# EAGLE design Z80_mini (EAGLE 8.1.0)
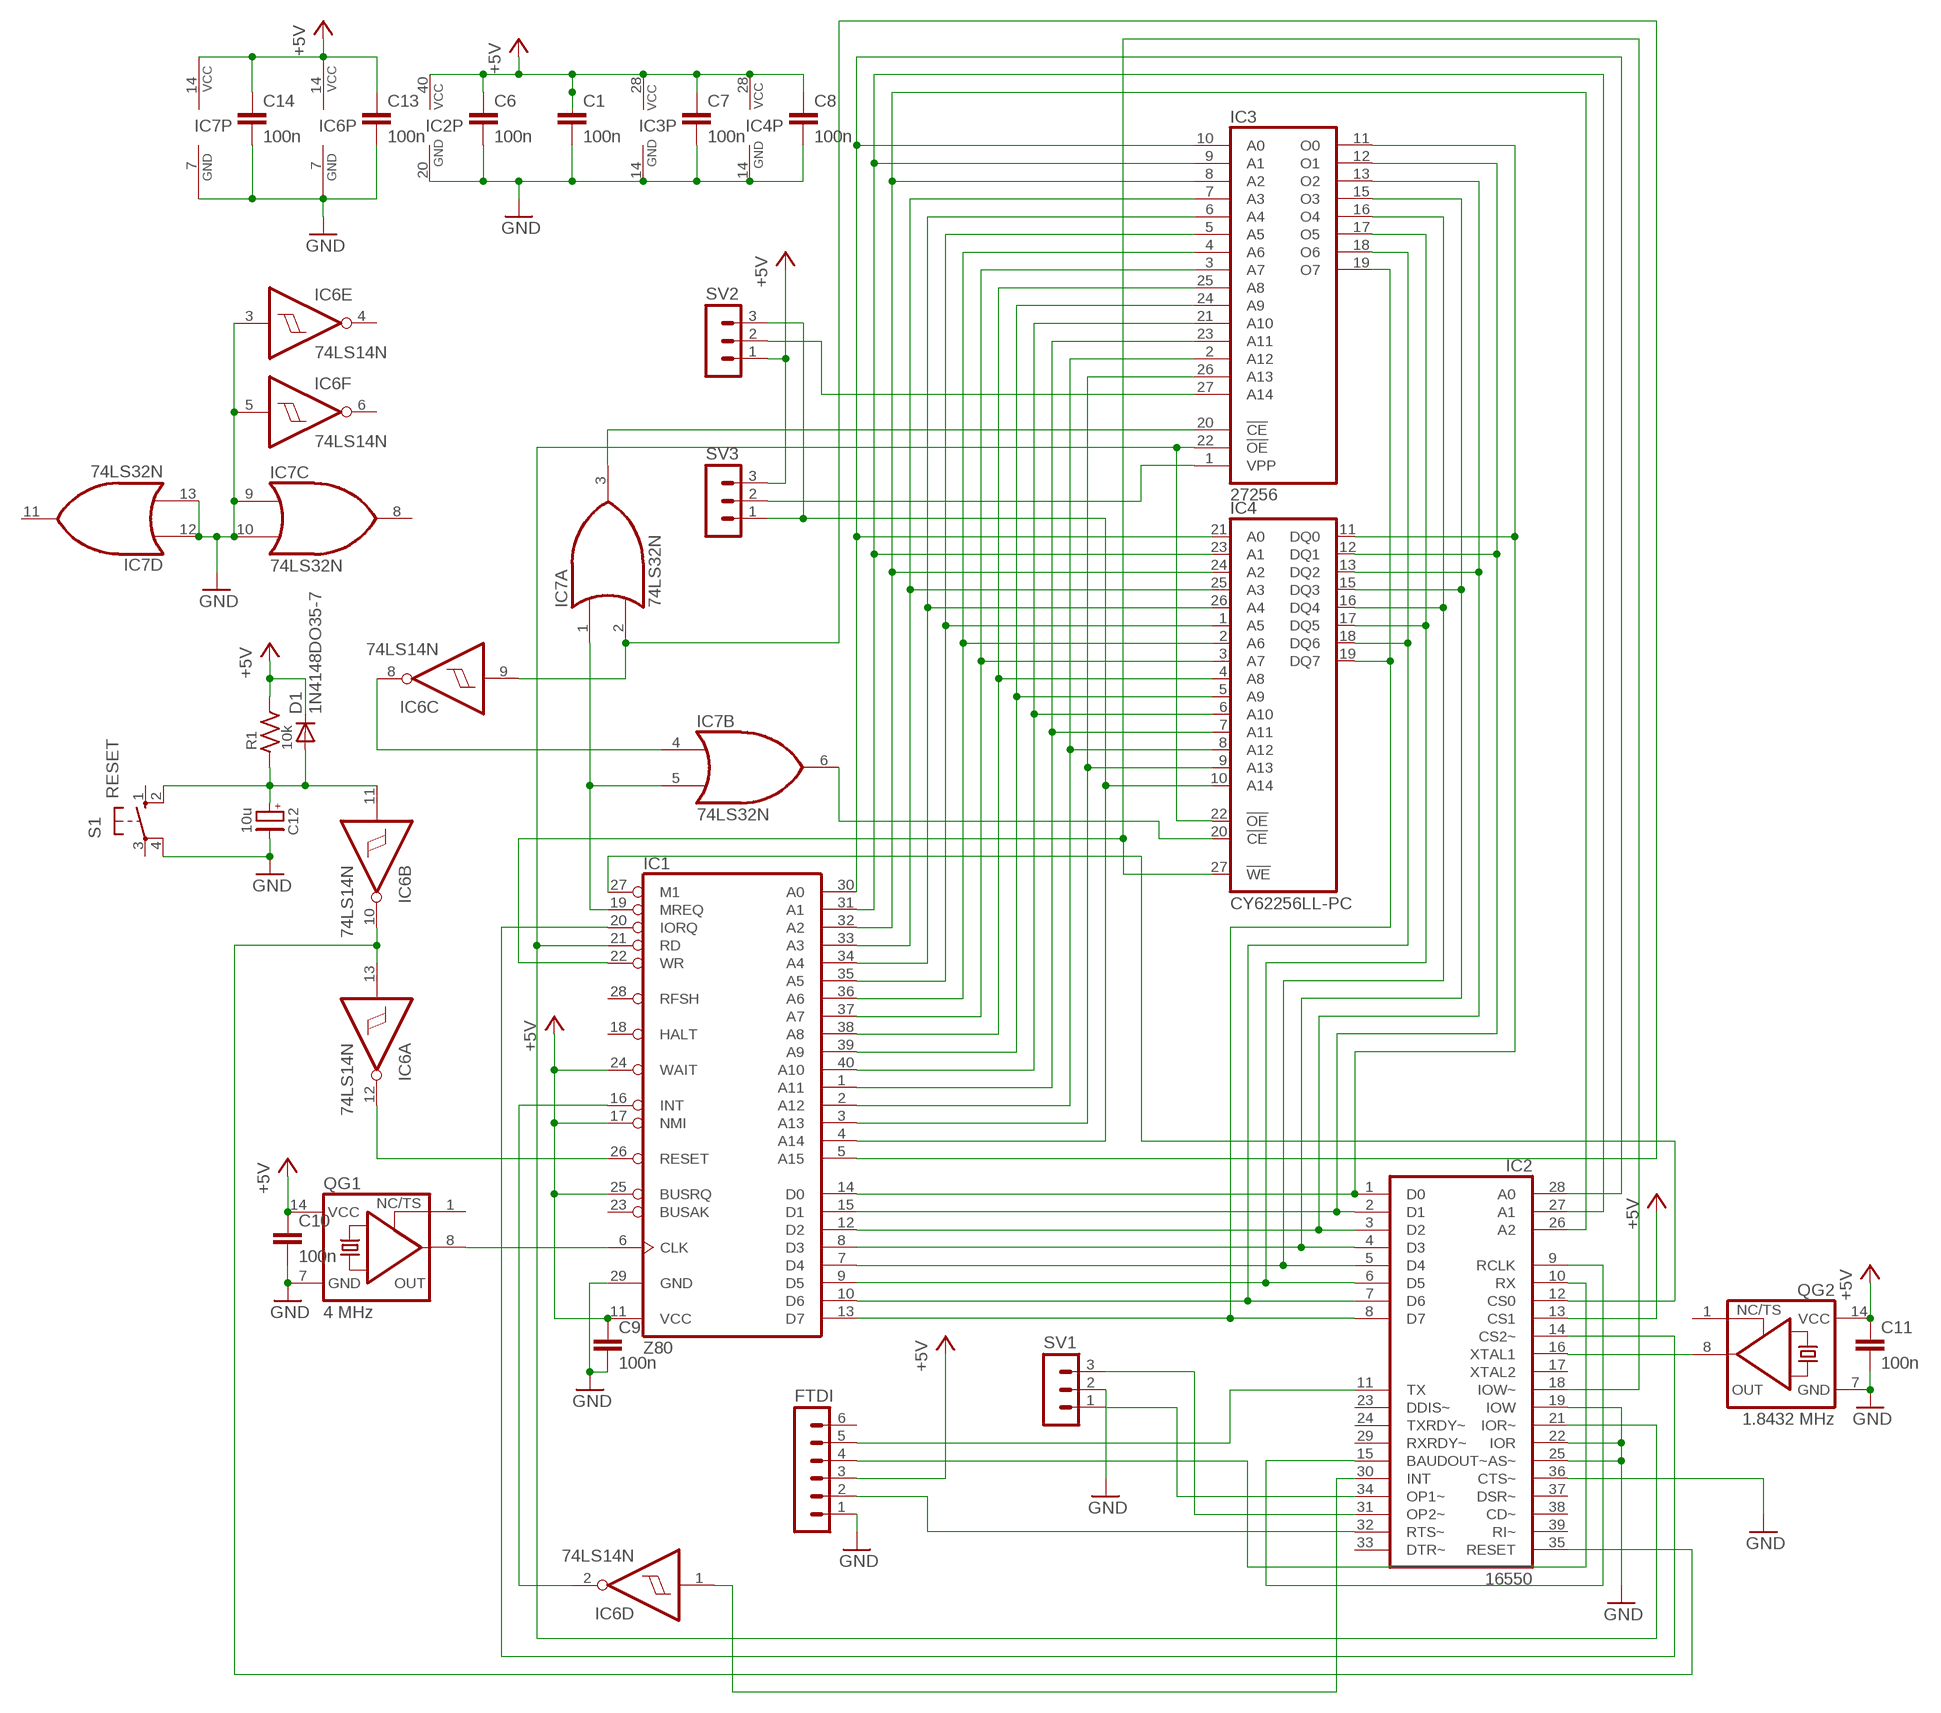
[diagram p0: schematic, sheet 1]

## Parts
C1  100n  C5/2.5  [C5B2.5]
C6  100n  C5/2.5  [C5B2.5]
C7  100n  C5/2.5  [C5B2.5]
C8  100n  C5/2.5  [C5B2.5]
C9  100n  C5/2.5  [C5B2.5]
C10  100n  C5/2.5  [C5B2.5]
C11  100n  C5/2.5  [C5B2.5]
C12  10u  CE01A  [CE01A]
C13  100n  C5/2.5  [C5B2.5]
C14  100n  C5/2.5  [C5B2.5]
D1  1N4148DO35-7  [DO35-7]
FTDI  MA06-1  [MA06-1]
IC1  Z80  Z80CPU  [DIL40]
IC2  16550  XR-16C550P  [DIL40]
IC3  27256  [DIL28]
IC4  CY62256LL-PC  [DIL28-6]
IC6  74LS14N  [DIL14]
IC7  74LS32N  [DIL14]
QG1  4 MHz  XO-14  [DIL14S]
QG2  1.8432 MHz  XO-14  [DIL14S]
R1  10k  RU  [R04N]
S1  RESET  10-XX  [B3F-10XX]
SV1  MA03-1  [MA03-1]
SV2  MA03-1  [MA03-1]
SV3  MA03-1  [MA03-1]

## Nets
+5V: C1.1 C6.1 C7.1 C8.1 C9.1 C10.1 C11.1 C13.1 C14.1 D1.C FTDI.3 IC1.11(VCC) IC1.17(NMI) IC1.24(WAIT) IC1.25(BUSRQ) IC2.13(CS1) IC2.40(VCC) IC3.28(VCC) IC4.28(VCC) IC6.14(P:VCC) IC7.14(P:VCC) QG1.14(VCC) QG2.14(VCC) R1.2 SV2.1 SV3.3
GND: C1.2 C6.2 C7.2 C8.2 C9.2 C10.2 C11.2 C12.- C13.2 C14.2 FTDI.1 IC1.29(GND) IC2.19(IOW) IC2.20(GND) IC2.22(IOR) IC2.25(AS~) IC2.36(CTS~) IC3.14(GND) IC4.14(GND) IC6.3(E:I) IC6.5(F:I) IC6.7(P:GND) IC7.7(P:GND) IC7.9(C:I0) IC7.10(C:I1) IC7.12(D:I0) IC7.13(D:I1) QG1.7(GND) QG2.7(GND) S1.4(P1) SV1.2
N$1: IC1.14(D0) IC2.1(D0) IC3.11(O0) IC4.11(DQ0)
N$2: IC1.15(D1) IC2.2(D1) IC3.12(O1) IC4.12(DQ1)
N$3: IC1.12(D2) IC2.3(D2) IC3.13(O2) IC4.13(DQ2)
N$4: IC1.8(D3) IC2.4(D3) IC3.15(O3) IC4.15(DQ3)
N$5: IC1.7(D4) IC2.5(D4) IC3.16(O4) IC4.16(DQ4)
N$6: IC1.9(D5) IC2.6(D5) IC3.17(O5) IC4.17(DQ5)
N$7: IC1.10(D6) IC2.7(D6) IC3.18(O6) IC4.18(DQ6)
N$8: IC1.13(D7) IC2.8(D7) IC3.19(O7) IC4.19(DQ7)
N$9: IC1.30(A0) IC2.28(A0) IC3.10(A0) IC4.21(A0)
N$10: IC1.31(A1) IC2.27(A1) IC3.9(A1) IC4.23(A1)
N$11: IC1.32(A2) IC2.26(A2) IC3.8(A2) IC4.24(A2)
N$12: IC1.33(A3) IC3.7(A3) IC4.25(A3)
N$13: IC1.34(A4) IC3.6(A4) IC4.26(A4)
N$14: IC1.35(A5) IC3.5(A5) IC4.1(A5)
N$15: IC1.36(A6) IC3.4(A6) IC4.2(A6)
N$16: IC1.37(A7) IC3.3(A7) IC4.3(A7)
N$17: IC1.38(A8) IC3.25(A8) IC4.4(A8)
N$18: IC1.39(A9) IC3.24(A9) IC4.5(A9)
N$19: IC1.40(A10) IC3.21(A10) IC4.6(A10)
N$20: IC1.1(A11) IC3.23(A11) IC4.7(A11)
N$21: IC1.2(A12) IC3.2(A12) IC4.8(A12)
N$22: IC1.3(A13) IC3.26(A13) IC4.9(A13)
N$23: IC1.4(A14) IC4.10(A14) SV2.3 SV3.1
N$24: FTDI.4 IC2.10(RX)
N$25: IC1.21(RD) IC2.21(IOR~) IC3.22(!OE) IC4.22(!OE)
N$26: IC1.22(WR) IC2.18(IOW~) IC4.27(!WE)
N$27: IC1.27(M1) IC2.12(CS0)
N$28: FTDI.2 IC2.32(RTS~)
N$29: IC3.1(VPP) SV3.2
N$30: FTDI.5 IC2.11(TX)
N$31: IC3.27(A14) SV2.2
N$32: IC2.31(OP2~) SV1.3
N$33: IC2.34(OP1~) SV1.1
N$36: IC1.6(CLK) QG1.8(OUT)
N$37: IC1.26(RESET) IC6.12(A:O)
N$38: IC2.16(XTAL1) QG2.8(OUT)
N$39: IC2.9(RCLK) IC2.15(BAUDOUT~)
N$40: IC1.20(IORQ) IC2.14(CS2~)
N$41: IC2.35(RESET) IC6.10(B:O) IC6.13(A:I)
N$43: C12.+ D1.A IC6.11(B:I) R1.1 S1.2(S1)
N$44: IC1.19(MREQ) IC7.1(A:I0) IC7.5(B:I1)
N$46: IC3.20(!CE) IC7.3(A:O)
N$47: IC6.8(C:O) IC7.4(B:I0)
N$48: IC4.20(!CE) IC7.6(B:O)
N$49: IC2.30(INT) IC6.1(D:I)
N$50: IC1.16(INT) IC6.2(D:O)
N$52: IC1.5(A15) IC6.9(C:I) IC7.2(A:I1)
Unconnected: FTDI.6 IC1.18(HALT) IC1.23(BUSAK) IC1.28(RFSH) IC2.17(XTAL2) IC2.23(DDIS~) IC2.24(TXRDY~) IC2.29(RXRDY~) IC2.33(DTR~) IC2.37(DSR~) IC2.38(CD~) IC2.39(RI~) IC6.4(E:O) IC6.6(F:O) IC7.8(C:O) IC7.11(D:O) QG1.1(TS) QG2.1(TS) S1.1(S) S1.3(P)

## Library data of the parts
C1 C6-C11 C13 C14 = capacitor-wima:C: CAPACITOR naming: grid - package width
C12 = divers:CE: Electrolytic capacitor Unipolar
D1 = diode:1N4148: DIODE high speed (Philips)
FTDI = con-lstb:MA06-1: PIN HEADER; OC_FARNELL: unknown; OC_NEWARK: unknown
IC1 = zilog:Z80CPU: Z80 FAMILY DEVICE
IC2 = exar:XR-16C550P: UART/FIFO
IC3 = memory:27256: MEMORY
IC4 = memory-sram:CY62256LL-?*: 256K (32K x 8) CMOS-Static RAM Source: http://download.cypress.com.edgesuite.net/design_resources/datasheets/contents/cy62256_8.pdf
IC6 = 74xx-us:74*14: Hex schmitt trigger INVERTER
IC7 = 74xx-us:74*32: Quad 2-input OR gate
QG1 QG2 = crystal:XO-: CRYSTAL
R1 = divers:RU: Resistor, US symbol
S1 = switch-omron:10-XX: OMRON SWITCH
SV1-SV3 = con-lstb:MA03-1: PIN HEADER; OC_FARNELL: unknown; OC_NEWARK: unknown

## Net classes
0 +5V: width 0.508 mm

## Board
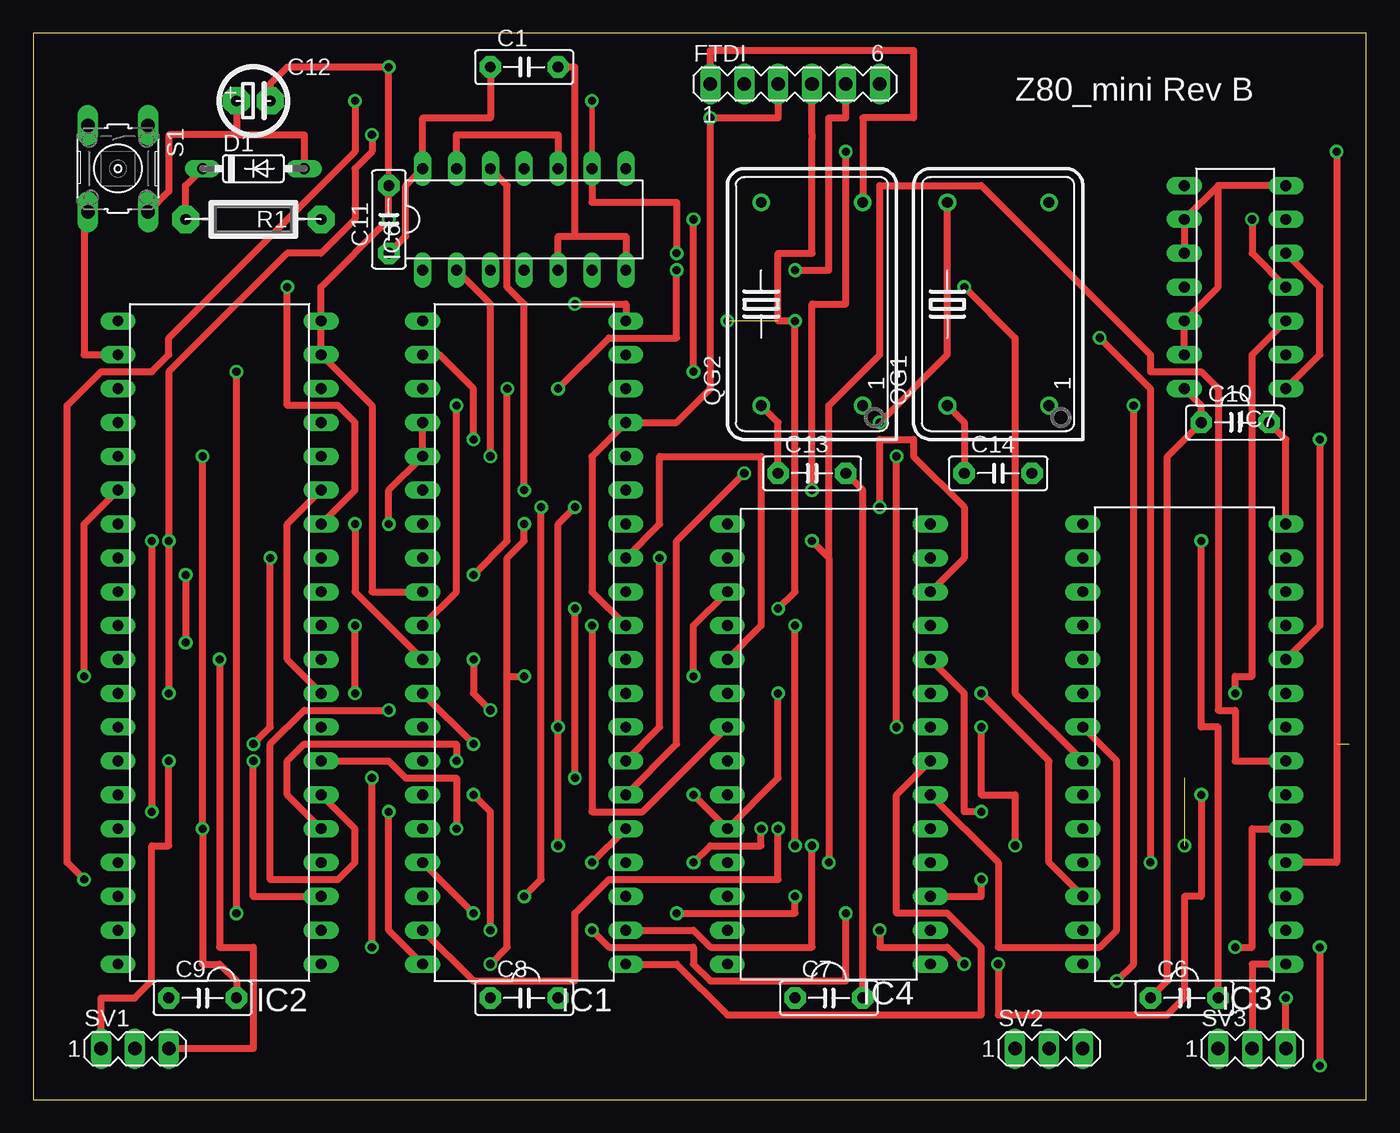
[diagram p1: board, top side]
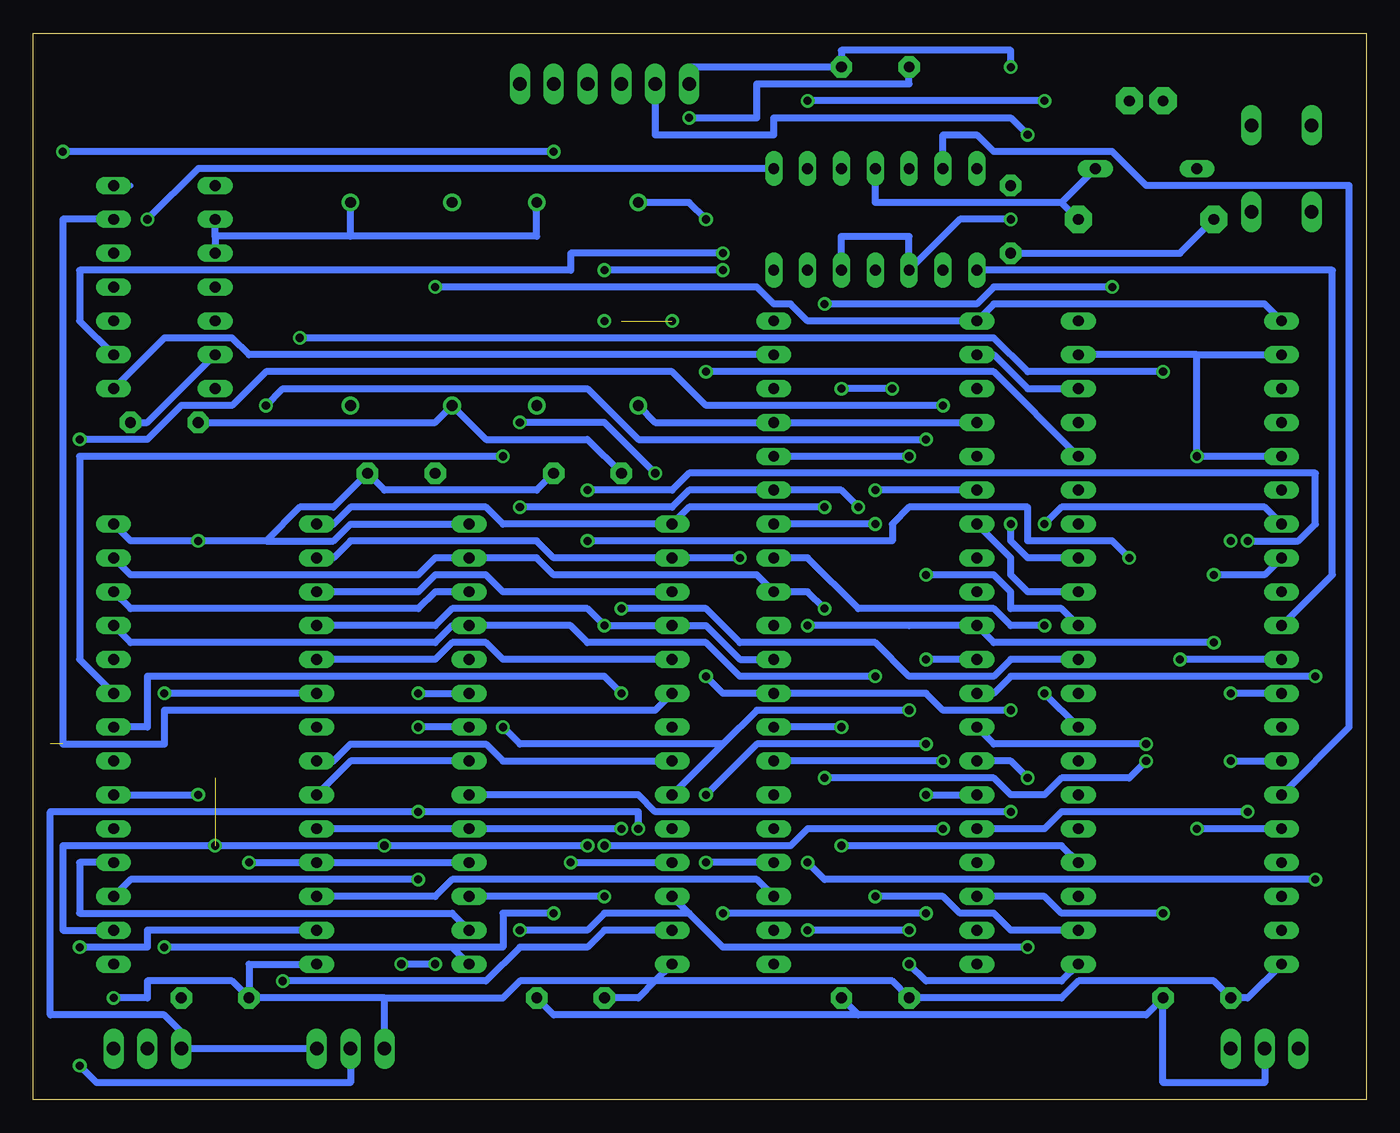
[diagram p2: board, bottom side, seen from below]

Size 100 x 80 mm. Coordinates in mm from the lower left corner, seen from the top.
Outline: 0,0 100,0 100,80 0,80 0,0
Copper layers (1*16): Top 0.035mm / dielectric 1.5mm / Bottom 0.035mm
Design rules "default *": minimum track width 20mil, minimum drill 24mil, track to track 8mil, track to pad 8mil, pad to pad 8mil, via to via 8mil, smd to smd 8mil, copper to edge 40mil, drill to drill 8mil, minimum pad ring 10mil, minimum via ring 8mil, stop-mask expansion 4mil, vias tented up to drill 0mil, thermal gap 10mil

### Footprints (pad centres in the part's own frame; a part is rotated, then mirrored left to right if it is on the bottom)
C5B2.5 = drill 0.813 pad 1.6 octagon: 1 -2.54,0; 2 2.54,0
CE01A = drill 0.813 pad 2.032 octagon: + -1.27,0; - 1.27,0
DO35-7 = drill 0.813 long: A 3.81,0; C -3.81,0
MA06-1 = drill 1.016 long: 1 -6.35,0; 2 -3.81,0; 3 -1.27,0; 4 1.27,0; 5 3.81,0; 6 6.35,0
DIL40 = drill 0.813 long: 1 -24.13,-7.62; 2 -21.59,-7.62; 3 -19.05,-7.62; 4 -16.51,-7.62; 5 -13.97,-7.62; 6 -11.43,-7.62; 7 -8.89,-7.62; 8 -6.35,-7.62; 9 -3.81,-7.62; 10 -1.27,-7.62; 11 1.27,-7.62; 12 3.81,-7.62; 13 6.35,-7.62; 14 8.89,-7.62; 15 11.43,-7.62; 16 13.97,-7.62; 17 16.51,-7.62; 18 19.05,-7.62; 19 21.59,-7.62; 20 24.13,-7.62; 21 24.13,7.62; 22 21.59,7.62; 23 19.05,7.62; 24 16.51,7.62; 25 13.97,7.62; 26 11.43,7.62; 27 8.89,7.62; 28 6.35,7.62; 29 3.81,7.62; 30 1.27,7.62; 31 -1.27,7.62; 32 -3.81,7.62; 33 -6.35,7.62; 34 -8.89,7.62; 35 -11.43,7.62; 36 -13.97,7.62; 37 -16.51,7.62; 38 -19.05,7.62; 39 -21.59,7.62; 40 -24.13,7.62
DIL28 = drill 0.813 long: 1 -16.51,-7.62; 2 -13.97,-7.62; 3 -11.43,-7.62; 4 -8.89,-7.62; 5 -6.35,-7.62; 6 -3.81,-7.62; 7 -1.27,-7.62; 8 1.27,-7.62; 9 3.81,-7.62; 10 6.35,-7.62; 11 8.89,-7.62; 12 11.43,-7.62; 13 13.97,-7.62; 14 16.51,-7.62; 15 16.51,7.62; 16 13.97,7.62; 17 11.43,7.62; 18 8.89,7.62; 19 6.35,7.62; 20 3.81,7.62; 21 1.27,7.62; 22 -1.27,7.62; 23 -3.81,7.62; 24 -6.35,7.62; 25 -8.89,7.62; 26 -11.43,7.62; 27 -13.97,7.62; 28 -16.51,7.62
DIL28-6 = drill 0.813 long: 1 -16.51,-7.62; 2 -13.97,-7.62; 3 -11.43,-7.62; 4 -8.89,-7.62; 5 -6.35,-7.62; 6 -3.81,-7.62; 7 -1.27,-7.62; 8 1.27,-7.62; 9 3.81,-7.62; 10 6.35,-7.62; 11 8.89,-7.62; 12 11.43,-7.62; 13 13.97,-7.62; 14 16.51,-7.62; 15 16.51,7.62; 16 13.97,7.62; 17 11.43,7.62; 18 8.89,7.62; 19 6.35,7.62; 20 3.81,7.62; 21 1.27,7.62; 22 -1.27,7.62; 23 -3.81,7.62; 24 -6.35,7.62; 25 -8.89,7.62; 26 -11.43,7.62; 27 -13.97,7.62; 28 -16.51,7.62
DIL14 = drill 0.813 long: 1 -7.62,-3.81; 2 -5.08,-3.81; 3 -2.54,-3.81; 4 0,-3.81; 5 2.54,-3.81; 6 5.08,-3.81; 7 7.62,-3.81; 8 7.62,3.81; 9 5.08,3.81; 10 2.54,3.81; 11 0,3.81; 12 -2.54,3.81; 13 -5.08,3.81; 14 -7.62,3.81
DIL14S = drill 0.813: 1 -7.62,-3.81; 7 7.62,-3.81; 8 7.62,3.81; 14 -7.62,3.81
R04N = drill 0.813 pad 2.032 octagon: 1 -5.08,0; 2 5.08,0
B3F-10XX = drill 1.016 long: 1 -3.251,2.261; 2 3.251,2.261; 3 -3.251,-2.261; 4 3.251,-2.261
MA03-1 = drill 1.016 long: 1 -2.54,0; 2 0,0; 3 2.54,0

### Placement (x,y rotation side)
C1  36.83,77.47 0 top
C6  86.36,7.62 0 top
C7  59.69,7.62 0 top
C8  36.83,7.62 0 top
C9  12.7,7.62 0 top
C10  90.17,50.8 0 top
C11  26.67,66.04 90 top
C12  16.51,74.93 0 top
C13  58.42,46.99 0 top
C14  72.39,46.99 0 top
D1  16.51,69.85 0 top
FTDI  57.15,76.2 0 top
IC1  36.83,34.29 90 top
IC2  13.97,34.29 90 top
IC3  86.36,26.67 90 top
IC4  59.69,26.67 90 top
IC6  36.83,66.04 0 top
IC7  90.17,60.96 90 top
QG1  72.39,59.69 90 top
QG2  58.42,59.69 90 top
R1  16.51,66.04 180 top
S1  6.35,69.85 270 top
SV1  7.62,3.81 0 top
SV2  76.2,3.81 0 top
SV3  91.44,3.81 0 top

### Tracks (layer width: path | path; a pad name or v marks a point on that pad's centre or on a via)
+5V  (via drill 0.61)
  Top 0.406: 34.29,73.66 30.48,73.66
  Top 0.508: D1.C 11.43,68.58 R1.2 | IC1.24 IC1.25 26.67,45.72 v26.67,43.18 | C11.1 27.94,64.77 27.94,68.58 IC6.14 29.21,73.66 34.29,73.66 C1.1 | IC7.14 87.63,52.07 C10.1 85.09,48.26 85.09,8.89 C6.1 | QG1.14 69.85,50.8 C14.1 | QG2.14 55.88,50.8 C13.1 | IC1.11 41.91,38.1 41.91,48.26 IC1.17 48.26,50.8 50.8,53.34 v50.8,73.66 55.88,73.66 FTDI.3 | SV3.3 v93.98,7.62
  Bottom 0.508: IC3.28 83.82,10.16 C6.1 | IC2.40 8.89,7.62 C9.1 11.43,8.89 21.59,8.89 22.86,7.62 C8.1 35.56,8.89 53.34,8.89 | 53.34,8.89 54.61,7.62 C7.1 | 53.34,8.89 IC4.28 | 73.66,7.62 64.77,7.62 63.5,8.89 53.34,8.89 | 73.66,7.62 C6.1 | R1.2 13.97,63.5 C11.1 | C10.1 69.85,50.8 QG1.14 66.04,49.53 58.42,49.53 C13.1 | QG2.14 53.34,50.8 IC1.17 IC1.24 | v26.67,43.18 26.67,41.91 25.4,40.64 IC2.13 | C6.1 85.09,8.89 91.44,8.89 91.44,7.62 v93.98,7.62 | v50.8,73.66 45.72,73.66 45.72,76.2 34.29,76.2 C1.1 | SV2.1 73.66,7.62
GND  (via drill 0.61)
  Top 0.406: C11.2 26.67,69.85
  Top 0.508: IC6.7 44.45,64.77 40.64,64.77 | 40.64,64.77 39.37,64.77 IC6.5 | IC1.29 25.4,38.1 25.4,52.07 IC2.19 IC2.20 21.59,60.96 v26.67,66.04 C11.2 | IC7.13 IC7.12 88.9,60.96 88.9,68.58 | C10.2 93.98,49.53 IC3.14 | IC7.10 IC7.9 88.9,68.58 | C7.2 62.23,45.72 C13.2 | IC7.7 88.9,68.58 | C9.2 15.24,8.89 13.97,10.16 12.7,10.16 v12.7,20.32 v12.7,48.26 | S1.4 3.81,66.32 3.81,55.88 IC2.22 | C12.- 17.78,76.2 19.05,77.47 v26.67,77.47 26.67,69.85 | 40.64,64.77 40.64,77.47 C1.2 | C6.2 88.9,27.94 87.63,27.94 v87.63,41.91 | FTDI.1 50.8,78.73 66.04,78.73 66.04,73.66 62.23,73.66 QG2.7
  Bottom 0.406: 92.71,68.58 IC7.7
  Bottom 0.508: v26.67,66.04 30.48,66.04 IC6.3 34.29,64.77 39.37,64.77 IC6.5 | 12.7,55.88 IC2.19 | 38.1,6.35 16.51,6.35 C9.2 15.24,1.27 7.62,1.27 SV1.2 | 38.1,6.35 C8.2 | C7.2 60.96,6.35 38.1,6.35 | C13.2 62.23,45.72 73.66,45.72 C14.2 77.47,44.45 80.01,44.45 82.55,41.91 | IC4.14 76.2,43.18 77.47,41.91 82.55,41.91 | 82.55,41.91 v87.63,41.91 92.71,41.91 IC3.14 | IC7.13 91.44,50.8 C10.2 | QG2.7 62.23,64.77 76.2,64.77 | 76.2,64.77 QG1.7 | 12.7,55.88 IC2.22 | IC2.25 v12.7,48.26 12.7,55.88 | v26.67,77.47 26.67,78.73 39.37,78.73 C1.2 50.8,77.47 FTDI.1 | 76.2,64.77 86.36,64.77 | 86.36,64.77 IC7.9 | 86.36,64.77 IC7.10 | IC2.36 v12.7,20.32
N$1  (via drill 0.61)
  Top 0.508: v34.29,10.16 35.56,11.43 35.56,31.75 | 35.56,31.75 35.56,40.64 36.83,41.91 v36.83,43.18 | 35.56,31.75 v36.83,31.75
  Bottom 0.508: IC3.11 92.71,34.29 69.85,34.29 68.58,35.56 IC4.11 59.69,35.56 58.42,34.29 49.53,34.29 46.99,31.75 v36.83,31.75 | IC2.1 22.86,8.89 33.02,8.89 v34.29,10.16 | v36.83,43.18 IC1.14
N$2  (via drill 0.61)
  Top 0.508: v36.83,15.24 38.1,16.51 v38.1,44.45 | IC4.12 69.85,40.64 69.85,44.45 66.04,48.26 66.04,49.53 63.5,49.53 v63.5,44.45
  Bottom 0.508: IC4.12 69.85,38.1 71.12,36.83 92.71,36.83 IC3.12 | IC2.2 26.67,12.7 27.94,13.97 30.48,13.97 31.75,15.24 v36.83,15.24 | v38.1,44.45 39.37,45.72 IC1.15 50.8,45.72 52.07,44.45 v63.5,44.45
N$3  (via drill 0.61)
  Top 0.508: IC2.3 16.51,15.24 v16.51,25.4 | v40.64,24.13 v40.64,36.83
  Bottom 0.508: v16.51,25.4 17.78,24.13 22.86,24.13 24.13,22.86 26.67,22.86 27.94,24.13 v40.64,24.13 | v40.64,36.83 41.91,38.1 IC1.12 45.72,39.37 60.96,39.37 62.23,40.64 IC4.13 69.85,40.64 71.12,39.37 92.71,39.37 IC3.13
N$4  (via drill 0.61)
  Top 0.508: v39.37,19.05 v39.37,27.94 39.37,43.18 v40.64,44.45
  Bottom 0.508: IC3.15 77.47,43.18 76.2,44.45 66.04,44.45 64.77,43.18 IC4.15 50.8,44.45 v40.64,44.45 | IC2.4 22.86,19.05 v39.37,19.05 | v39.37,27.94 IC1.8
N$5  (via drill 0.61)
  Top 0.508: IC2.5 19.05,22.86 19.05,25.4 20.32,26.67 31.75,26.67 v31.75,25.4 | v46.99,40.64 46.99,27.94 IC1.7
  Bottom 0.508: IC3.16 77.47,40.64 76.2,41.91 62.23,41.91 60.96,40.64 IC4.16 v46.99,40.64 | v31.75,25.4 IC1.7
N$6  (via drill 0.61)
  Top 0.508: IC2.6 24.13,20.32 24.13,17.78 22.86,16.51 17.78,16.51 17.78,26.67 20.32,29.21 v26.67,29.21 | IC4.17 49.53,35.56 v49.53,31.75
  Bottom 0.508: IC4.17 64.77,38.1 66.04,39.37 69.85,39.37 71.12,38.1 IC3.17 | v26.67,29.21 31.75,29.21 33.02,30.48 IC1.9 48.26,30.48 v49.53,31.75
N$7  (via drill 0.61)
  Top 0.508: IC2.7 26.67,25.4 27.94,24.13 31.75,24.13 v31.75,20.32 | v57.15,19.05 v57.15,35.56
  Bottom 0.508: v31.75,20.32 41.91,20.32 43.18,19.05 v57.15,19.05 | IC1.10 46.99,33.02 49.53,35.56 IC4.18 v57.15,35.56 58.42,36.83 68.58,36.83 69.85,35.56 IC3.18
N$8  (via drill 0.61)
  Top 0.508: v24.13,30.48 v24.13,35.56 | IC4.19 54.61,35.56 54.61,48.26 46.99,48.26 46.99,43.18 IC1.13
  Bottom 0.508: IC4.19 64.77,33.02 66.04,34.29 68.58,34.29 69.85,33.02 IC3.19 | IC2.8 v24.13,30.48 | IC1.13 41.91,40.64 38.1,36.83 27.94,36.83 26.67,35.56 v24.13,35.56
N$9  (via drill 0.61)
  Top 0.508: IC4.21 45.72,21.59 41.91,21.59 v41.91,35.56 | IC3.10 96.52,35.56 v96.52,49.53 | v31.75,52.07 31.75,38.1 IC1.30 | v11.43,39.37 v11.43,34.29
  Bottom 0.508: v41.91,35.56 34.29,35.56 IC1.30 27.94,34.29 v11.43,34.29 | v96.52,49.53 91.44,49.53 88.9,52.07 85.09,52.07 82.55,54.61 52.07,54.61 49.53,52.07 v31.75,52.07 | IC2.28 7.62,39.37 v11.43,39.37
N$10  (via drill 0.61)
  Top 0.508: IC1.31 24.13,38.1 v24.13,43.18 | v34.29,29.21 33.02,30.48 v33.02,33.02 | v64.77,27.94 v64.77,48.26
  Bottom 0.508: v24.13,43.18 22.86,44.45 7.62,44.45 IC2.27 | 48.26,26.67 45.72,29.21 v34.29,29.21 | 48.26,26.67 IC4.23 | IC1.31 v33.02,33.02 | IC3.9 96.52,33.02 96.52,48.26 v64.77,48.26 | v64.77,27.94 63.5,26.67 48.26,26.67
N$11  (via drill 0.61)
  Top 0.508: v3.81,31.75 3.81,43.18 IC2.26 | v55.88,30.48 55.88,24.13 IC4.24 v49.53,22.86 | IC1.32 v33.02,26.67
  Bottom 0.508: IC1.32 27.94,30.48 26.67,31.75 v3.81,31.75 | v55.88,30.48 57.15,31.75 91.44,31.75 91.44,27.94 IC3.8 | v33.02,26.67 45.72,26.67 v49.53,22.86
N$12  (via drill 0.61)
  Top 0.508: v16.51,26.67 17.78,27.94 v17.78,40.64 | v58.42,41.91 59.69,40.64 | 59.69,40.64 v59.69,17.78 | 59.69,40.64 59.69,52.07 63.5,55.88 63.5,68.58 71.12,68.58 83.82,55.88 83.82,54.61 87.63,54.61 88.9,53.34 88.9,29.21 90.17,29.21 90.17,25.4 IC3.7
  Bottom 0.508: IC1.33 27.94,26.67 v16.51,26.67 | v17.78,40.64 19.05,41.91 25.4,41.91 25.4,44.45 34.29,44.45 35.56,43.18 35.56,41.91 v58.42,41.91 | v59.69,17.78 IC4.25
N$13  (via drill 0.61)
  Top 0.508: v25.4,11.43 v25.4,24.13 | v72.39,10.16 72.39,6.35 85.09,6.35 86.36,7.62 86.36,15.24 87.63,15.24 v87.63,22.86 | v69.85,10.16 68.58,11.43 63.5,11.43 v63.5,12.7
  Bottom 0.508: IC1.34 26.67,25.4 v25.4,24.13 | v25.4,11.43 48.26,11.43 50.8,13.97 | 50.8,13.97 IC4.26 | v69.85,10.16 v72.39,10.16 | v63.5,12.7 58.42,12.7 57.15,13.97 50.8,13.97 | IC3.6 v87.63,22.86
N$14  (via drill 0.61)
  Top 0.508: v90.17,11.43 91.44,11.43 91.44,20.32 IC3.5 | v33.02,22.86 34.29,21.59 v34.29,12.7 | v41.91,12.7 43.18,11.43 49.53,11.43 49.53,10.16 50.8,8.89 60.96,8.89 v60.96,13.97
  Bottom 0.508: 68.58,11.43 IC4.1 | 68.58,11.43 v90.17,11.43 | v33.02,22.86 IC1.35 | v34.29,12.7 v41.91,12.7 | v60.96,13.97 64.77,13.97 64.77,11.43 68.58,11.43
N$15  (via drill 0.61)
  Top 0.508: v58.42,45.72 58.42,59.69 60.96,59.69 v60.96,71.12 | v97.79,71.12 97.79,17.78 IC3.4 | v8.89,41.91 v8.89,21.59
  Bottom 0.406: 17.78,21.59 19.05,21.59
  Bottom 0.508: IC4.2 68.58,13.97 96.52,13.97 96.52,17.78 IC3.4 | IC1.36 24.13,20.32 22.86,21.59 19.05,21.59 17.78,21.59 v8.89,21.59 | v8.89,41.91 5.08,41.91 3.81,43.18 3.81,46.99 50.8,46.99 52.07,45.72 v58.42,45.72 | v60.96,71.12 v97.79,71.12
N$16  (via drill 0.61)
  Top 0.508: IC4.3 71.12,15.24 v71.12,16.51 | IC1.37 v33.02,13.97 | v48.26,13.97 57.15,13.97 v57.15,15.24
  Bottom 0.508: v71.12,16.51 92.71,16.51 IC3.3 | v33.02,13.97 v48.26,13.97 | v57.15,15.24 IC4.3
N$17  (via drill 0.61)
  Top 0.508: v15.24,13.97 v15.24,54.61 | v80.01,57.15 83.82,53.34 v83.82,17.78
  Bottom 0.508: IC1.38 24.13,15.24 22.86,13.97 v15.24,13.97 | v15.24,54.61 25.4,54.61 27.94,57.15 v80.01,57.15 | v83.82,17.78 IC3.25 IC4.4
N$18  (via drill 0.61)
  Top 0.508: IC1.39 33.02,8.89 40.64,8.89 40.64,13.97 43.18,16.51 55.88,16.51 v55.88,20.32
  Bottom 0.508: v55.88,20.32 IC4.5 IC3.24
N$19  (via drill 0.61)
  Top 0.508: IC1.40 26.67,12.7 v26.67,21.59 | IC3.21 81.28,25.4 81.28,12.7 80.01,11.43 72.39,11.43 72.39,17.78 IC4.6
  Bottom 0.508: v26.67,21.59 53.34,21.59 54.61,22.86 IC4.6
N$20
  Top 0.508: IC1.1 48.26,10.16 52.07,6.35 71.12,6.35 71.12,11.43 68.58,13.97 64.77,13.97 64.77,22.86 IC4.7
  Bottom 0.508: IC3.23 76.2,25.4 IC4.7
N$21  (via drill 0.61)  (2 unrouted)
  Top 0.508: IC1.2 49.53,12.7 50.8,11.43 58.42,11.43 v58.42,19.05 | v71.12,27.94 71.12,22.86 73.66,22.86 v73.66,19.05
  Bottom 0.508: v58.42,19.05 v73.66,19.05 v86.36,19.05 97.79,19.05 97.79,12.7 IC3.2 | IC4.8 v71.12,27.94
N$22  (via drill 0.61)
  Top 0.508: v71.12,30.48 76.2,25.4 76.2,17.78 IC3.26
  Bottom 0.508: IC1.3 45.72,16.51 68.58,16.51 69.85,15.24 IC3.26 | v71.12,30.48 IC4.9
N$23  (via drill 0.61)
  Top 0.508: IC4.10 69.85,30.48 69.85,21.59 v71.12,21.59 | v49.53,17.78 50.8,19.05 54.61,19.05 v54.61,20.32
  Bottom 0.508: IC1.4 v49.53,17.78 | v54.61,20.32 54.61,21.59 v71.12,21.59 98.73,21.59 98.73,6.35 90.17,6.35 88.9,5.08 SV3.1 SV2.3
N$24  (via drill 0.61)  (1 unrouted)
  Top 0.508: v55.88,36.83 57.15,38.1 v57.15,58.42 55.88,58.42 55.88,63.5 58.42,63.5 58.42,72.13 58.42,72.39 FTDI.4
  Bottom 0.508: IC2.10 26.67,33.02 27.94,31.75 34.29,31.75 36.83,34.29 46.99,34.29 49.53,36.83 v55.88,36.83
  other vias: 52.07,58.42
N$25  (via drill 0.61)
  Top 0.508: v69.85,60.96 73.66,57.15 73.66,30.48 IC3.22
  Bottom 0.508: IC2.21 7.62,59.69 27.94,59.69 IC1.21 41.91,58.42 43.18,59.69 44.45,59.69 45.72,60.96 v69.85,60.96 | IC4.22 64.77,25.4 66.04,26.67 76.2,26.67 77.47,25.4 IC3.22
N$26  (via drill 0.61)
  Top 0.508: v81.28,8.89 82.55,10.16 v82.55,52.07 | v33.02,49.53 33.02,53.34 30.48,55.88 IC1.22
  Bottom 0.508: IC2.18 25.4,53.34 27.94,55.88 IC1.22 | IC4.27 57.15,12.7 58.42,11.43 63.5,11.43 66.04,8.89 v81.28,8.89 | v82.55,52.07 81.28,53.34 58.42,53.34 54.61,49.53 v33.02,49.53
N$27
  Bottom 0.406: 22.86,38.1 IC2.12
  Bottom 0.508: IC2.12 25.4,38.1 26.67,39.37 26.67,40.64 IC1.27
N$28  (via drill 0.61)
  Top 0.508: v25.4,72.39 25.4,71.12 24.13,69.85 24.13,66.04 21.59,63.5 19.05,63.5 10.16,54.61 v10.16,41.91 v10.16,30.48
  Bottom 0.508: IC2.32 v10.16,30.48 | v25.4,72.39 26.67,73.66 44.45,73.66 44.45,72.39 53.34,72.39 FTDI.2
N$29
  Top 0.508: IC3.1 91.44,10.16 SV3.2
N$30  (via drill 0.61)
  Top 0.508: v33.02,39.37 35.56,41.91 v35.56,53.34 | v39.37,53.34 43.18,57.15 48.26,57.15 v48.26,62.23 | v57.15,62.23 59.69,62.23 59.69,73.66 60.96,73.66 FTDI.5
  Bottom 0.508: v35.56,53.34 v39.37,53.34 | v48.26,62.23 v57.15,62.23 | IC2.11 22.86,36.83 26.67,36.83 26.67,38.1 27.94,39.37 v33.02,39.37
N$31  (via drill 0.61)
  Top 0.508: v96.52,11.43 v96.52,2.54
  Bottom 0.508: IC3.27 91.44,12.7 91.44,11.43 v96.52,11.43 | SV2.2 76.2,1.27 95.25,1.27 v96.52,2.54
N$32  (via drill 0.61)
  Top 0.508: v13.97,33.02 13.97,11.43 16.51,11.43 16.51,3.81 SV1.3
  Bottom 0.508: IC2.31 v13.97,33.02
N$33  (via drill 0.61)
  Top 0.508: SV1.1 5.08,7.62 7.62,7.62 8.89,8.89 8.89,19.05 10.16,19.05 v10.16,25.4
  Bottom 0.508: v10.16,25.4 IC2.34
N$36  (via drill 0.61)
  Top 0.508: IC1.6 48.26,26.67 48.26,41.91 v53.34,46.99 | v63.5,50.8 68.58,55.88 QG1.8
  Bottom 0.508: v53.34,46.99 57.15,50.8 v63.5,50.8
N$37  (via drill 0.61)
  Top 0.508: v36.83,45.72 36.83,59.69 35.56,60.96 35.56,68.58 IC6.12
  Bottom 0.508: IC1.26 v36.83,45.72
N$38  (via drill 0.61)
  Top 0.508: v49.53,54.61 v49.53,66.04
  Bottom 0.508: IC2.16 27.94,54.61 v49.53,54.61 | v49.53,66.04 50.8,67.31 QG2.8
N$39
  Top 0.508: IC2.9 19.05,33.02 19.05,43.18 IC2.15
N$40  (via drill 0.61)
  Top 0.508: IC2.14 24.13,45.72 24.13,50.8 22.86,52.07 19.05,52.07 v19.05,60.96 | v40.64,59.69 44.45,59.69 IC1.20
  Bottom 0.508: v19.05,60.96 27.94,60.96 29.21,59.69 v40.64,59.69
N$41
  Top 0.508: IC6.10 39.37,72.39 31.75,72.39 IC6.13
  Bottom 0.508: IC2.35 1.27,27.94 1.27,68.58 16.51,68.58 19.05,71.12 27.94,71.12 29.21,72.39 31.75,72.39 IC6.13
N$43
  Top 0.508: D1.A 20.32,72.39 15.24,72.39 | C12.+ 15.24,72.39 | 15.24,72.39 10.16,72.39 10.16,68.15 S1.2
  Bottom 0.508: IC6.11 36.83,67.31 22.86,67.31 | R1.1 22.86,67.31 | 22.86,67.31 D1.A
N$44
  Top 0.508: IC7.1 96.52,55.88 96.52,60.96 IC7.5
  Bottom 0.508: IC1.19 83.82,55.88 85.09,57.15 90.17,57.15 IC7.1
N$46  (via drill 0.61)
  Top 0.508: IC7.3 91.44,55.88 91.44,31.75 90.17,31.75 v90.17,30.48
  Bottom 0.508: IC3.20 v90.17,30.48
N$47  (via drill 0.61)
  Top 0.508: IC7.4 91.44,63.5 v91.44,66.04
  Bottom 0.508: v91.44,66.04 87.63,69.85 IC6.8
N$48  (1 unrouted)
  Bottom 0.508: IC4.20 53.34,29.21 90.17,29.21 90.17,26.67 97.79,26.67 97.79,66.04 IC7.6
N$49
  Bottom 0.508: IC2.30 2.54,39.37 2.54,62.23 IC6.1
N$50  (via drill 0.61)
  Top 0.508: IC6.2 34.29,59.69 v34.29,48.26
  Bottom 0.508: v34.29,48.26 IC1.16
N$52  (via drill 0.61)
  Top 0.406: v41.91,74.93 IC6.9
  Top 0.508: v41.91,17.78 IC1.5 | v3.81,16.51 2.54,17.78 2.54,52.07 5.08,54.61 8.89,54.61 10.16,55.88 10.16,57.15 24.13,71.12 v24.13,74.93 | IC6.9 41.91,67.31 48.26,67.31 v48.26,63.5
  Bottom 0.508: v41.91,17.78 40.64,16.51 v3.81,16.51 | IC7.2 96.52,58.42 96.52,62.23 59.69,62.23 59.69,63.5 v48.26,63.5 | v24.13,74.93 v41.91,74.93

### Text on the board
tNames: Z80_mini Rev B